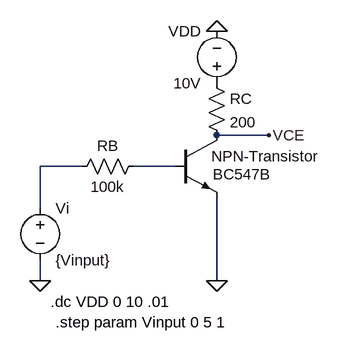
[diagram p0: schematic 2_2_1_g.asc]
2_2_1_g.asc, the LTspice schematic file:
Version 4
SHEET 1 880 680
WIRE 384 32 304 32
WIRE 96 80 32 80
WIRE 240 80 176 80
WIRE 32 144 32 80
WIRE 32 256 32 224
WIRE 304 256 304 128
FLAG 304 256 0
FLAG 32 256 0
FLAG 304 -128 0
FLAG 384 32 VCE
SYMBOL voltage 32 128 R0
SYMATTR InstName Vi
SYMATTR Value {Vinput}
SYMBOL res 80 96 R270
WINDOW 0 32 56 VTop 2
WINDOW 3 0 56 VBottom 2
SYMATTR InstName RB
SYMATTR Value 100k
SYMBOL npn 240 32 R0
WINDOW 3 58 60 Left 2
SYMATTR Value BC547B
SYMATTR InstName NPN-Transistor
SYMBOL res 288 -64 R0
SYMATTR InstName RC
SYMATTR Value 200
SYMBOL voltage 304 -32 R180
WINDOW 0 24 96 Left 2
WINDOW 3 24 16 Left 2
SYMATTR InstName VDD
SYMATTR Value 10V
TEXT 48 288 Left 2 !.dc VDD 0 10 .01
TEXT 56 320 Left 2 !.step param Vinput 0 5 1

The netlist it stands for:
* 2_2_1_g.asc
Vi N001 0 {Vinput}
RB N001 N002 100k
Q§NPN-Transistor VCE N002 0 0 BC547B
RC P001 VCE 200
VDD P001 0 10V
.model NPN NPN
.model PNP PNP
.lib standard.bjt
.dc VDD 0 10 .01
.step param Vinput 0 5 1
.backanno
.end